# Altium schematic sheet taj1050.SchDoc
size A4
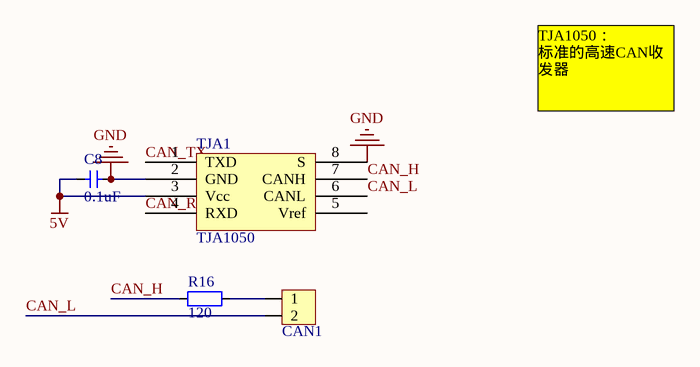
[diagram p0: taj1050.SchDoc]

## Parts
C8  value 0.1uF  [CAP_0603]  (hidden comment: Cap_0603)
CAN1  HDR1x2_2.54  [HDR1X2_2.54_180]  (value not drawn)
R16  value 120  [RES_0603]  (hidden comment: Res_0603)
TJA1  TJA1050  [SOP_E150_8]

## Nets
5V: C8.1 TJA1.3(Vcc)
GND: C8.2 TJA1.2(GND) TJA1.8(S)
CAN_H: R16.1 TJA1.7(CANH)
CAN_L: CAN1.2 TJA1.6(CANL)
CAN_RX: TJA1.4(RXD)
CAN_TX: TJA1.1(TXD)
NetCAN1_1: CAN1.1 R16.2

Not connected (* = marked no-connect by the designer): TJA1 5(Vref)

## Notes on the sheet
- TJA1050：
  标准的高速CAN收发器

## Library data of the parts
C8 = Cap_0603: Capacitor
CAN1 = HDR1x2_2.54: Header
R16 = Res_0603: Resistor
TJA1 = TJA1050: CAN总线收发器